# Altium schematic sheet S6.SchDoc
size A3; DocumentNumber: 7; SheetNumber: 7; SheetTotal: 8
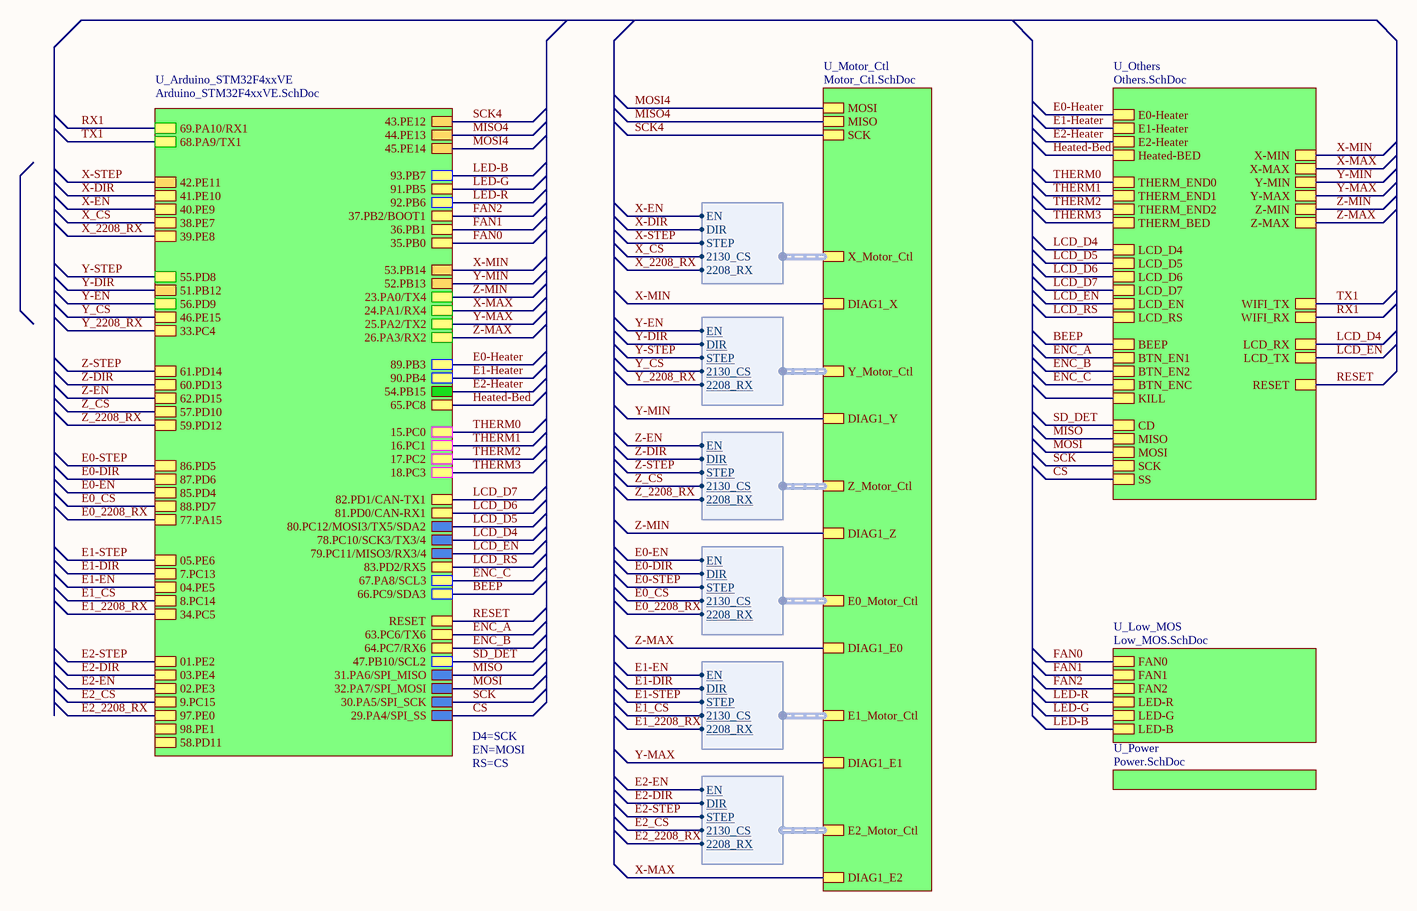
[diagram p0: S6.SchDoc]

## Sub-sheets
U_Arduino_STM32F4xxVE = Arduino_STM32F4xxVE.SchDoc: 23.PA0/TX4, 24.PA1/RX4, 25.PA2/TX2, 26.PA3/RX2, 29.PA4/SPI_SS, 30.PA5/SPI_SCK, 31.PA6/SPI_MISO, 32.PA7/SPI_MOSI, 67.PA8/SCL3, 77.PA15, 35.PB0, 36.PB1, 37.PB2/BOOT1, 89.PB3, 90.PB4, 91.PB5, 92.PB6, 93.PB7, 47.PB10/SCL2, 51.PB12, 52.PB13, 53.PB14, 54.PB15, 15.PC0, 16.PC1, 17.PC2, 18.PC3, 33.PC4, 65.PC8, 66.PC9/SDA3, 7.PC13, 8.PC14, 9.PC15, 85.PD4, 86.PD5, 87.PD6, 88.PD7, 55.PD8, 56.PD9, 57.PD10, 58.PD11, 59.PD12, 60.PD13, 61.PD14, 62.PD15, 97.PE0, 98.PE1, 01.PE2, 02.PE3, 03.PE4, 04.PE5, 05.PE6, 38.PE7, 39.PE8, 40.PE9, 34.PC5, 68.PA9/TX1, 69.PA10/RX1, RESET, 41.PE10, 42.PE11, 43.PE12, 44.PE13, 45.PE14, 46.PE15, 79.PC11/MISO3/RX3/4, 63.PC6/TX6, 81.PD0/CAN-RX1, 83.PD2/RX5, 78.PC10/SCK3/TX3/4, 64.PC7/RX6, 80.PC12/MOSI3/TX5/SDA2, 82.PD1/CAN-TX1
U_Low_MOS = Low_MOS.SchDoc: FAN0, FAN1, FAN2, LED-R, LED-G, LED-B
U_Motor_Ctl = Motor_Ctl.SchDoc: MOSI, MISO, SCK, X_Motor_Ctl (harness Motor), E0_Motor_Ctl (harness Motor), E2_Motor_Ctl (harness Motor), E1_Motor_Ctl (harness Motor), Z_Motor_Ctl (harness Motor), Y_Motor_Ctl (harness Motor), DIAG1_X, DIAG1_Y, DIAG1_Z, DIAG1_E2, DIAG1_E0, DIAG1_E1
U_Others = Others.SchDoc: Heated-BED, THERM_BED, X-MIN, X-MAX, Y-MIN, Y-MAX, Z-MIN, Z-MAX, BTN_ENC, LCD_RS, LCD_D5, LCD_D7, BEEP, LCD_EN, LCD_D4, LCD_D6, CD, BTN_EN2, BTN_EN1, MISO, KILL, MOSI, SS, SCK, E1-Heater, THERM_END2, E2-Heater, THERM_END1, E0-Heater, THERM_END0, RESET, LCD_RX, LCD_TX, WIFI_RX, WIFI_TX
U_Power = Power.SchDoc: no entries

## Harnesses
Motor: EN, DIR, STEP, 2130_CS, 2208_RX

## Nets
BEEP: sheet U_Others/BEEP, sheet U_Arduino_STM32F4xxVE/66.PC9/SDA3
CS: sheet U_Others/SS, sheet U_Arduino_STM32F4xxVE/29.PA4/SPI_SS
E0-DIR: sheet U_Arduino_STM32F4xxVE/87.PD6, sheet U_Motor_Ctl/E0_Motor_Ctl.DIR
E0-EN: sheet U_Arduino_STM32F4xxVE/85.PD4, sheet U_Motor_Ctl/E0_Motor_Ctl.EN
E0-Heater: sheet U_Others/E0-Heater, sheet U_Arduino_STM32F4xxVE/89.PB3
E0-STEP: sheet U_Arduino_STM32F4xxVE/86.PD5, sheet U_Motor_Ctl/E0_Motor_Ctl.STEP
E0_2208_RX: sheet U_Arduino_STM32F4xxVE/77.PA15, sheet U_Motor_Ctl/E0_Motor_Ctl.2208_RX
E0_CS: sheet U_Arduino_STM32F4xxVE/88.PD7, sheet U_Motor_Ctl/E0_Motor_Ctl.2130_CS
E1-DIR: sheet U_Arduino_STM32F4xxVE/7.PC13, sheet U_Motor_Ctl/E1_Motor_Ctl.DIR
E1-EN: sheet U_Arduino_STM32F4xxVE/04.PE5, sheet U_Motor_Ctl/E1_Motor_Ctl.EN
E1-Heater: sheet U_Others/E1-Heater, sheet U_Arduino_STM32F4xxVE/90.PB4
E1-STEP: sheet U_Arduino_STM32F4xxVE/05.PE6, sheet U_Motor_Ctl/E1_Motor_Ctl.STEP
E1_2208_RX: sheet U_Arduino_STM32F4xxVE/34.PC5, sheet U_Motor_Ctl/E1_Motor_Ctl.2208_RX
E1_CS: sheet U_Arduino_STM32F4xxVE/8.PC14, sheet U_Motor_Ctl/E1_Motor_Ctl.2130_CS
E2-DIR: sheet U_Arduino_STM32F4xxVE/03.PE4, sheet U_Motor_Ctl/E2_Motor_Ctl.DIR
E2-EN: sheet U_Arduino_STM32F4xxVE/02.PE3, sheet U_Motor_Ctl/E2_Motor_Ctl.EN
E2-Heater: sheet U_Others/E2-Heater, sheet U_Arduino_STM32F4xxVE/54.PB15
E2-STEP: sheet U_Arduino_STM32F4xxVE/01.PE2, sheet U_Motor_Ctl/E2_Motor_Ctl.STEP
E2_2208_RX: sheet U_Arduino_STM32F4xxVE/97.PE0, sheet U_Motor_Ctl/E2_Motor_Ctl.2208_RX
E2_CS: sheet U_Arduino_STM32F4xxVE/9.PC15, sheet U_Motor_Ctl/E2_Motor_Ctl.2130_CS
ENC_A: sheet U_Others/BTN_EN1, sheet U_Arduino_STM32F4xxVE/63.PC6/TX6
ENC_B: sheet U_Others/BTN_EN2, sheet U_Arduino_STM32F4xxVE/64.PC7/RX6
ENC_C: sheet U_Others/BTN_ENC, sheet U_Arduino_STM32F4xxVE/67.PA8/SCL3
FAN0: sheet U_Low_MOS/FAN0, sheet U_Arduino_STM32F4xxVE/35.PB0
FAN1: sheet U_Low_MOS/FAN1, sheet U_Arduino_STM32F4xxVE/36.PB1
FAN2: sheet U_Low_MOS/FAN2, sheet U_Arduino_STM32F4xxVE/37.PB2/BOOT1
Heated-Bed: sheet U_Others/Heated-BED, sheet U_Arduino_STM32F4xxVE/65.PC8
LCD_D4: sheet U_Others/LCD_D4, sheet U_Others/LCD_RX, sheet U_Arduino_STM32F4xxVE/78.PC10/SCK3/TX3/4
LCD_D5: sheet U_Others/LCD_D5, sheet U_Arduino_STM32F4xxVE/80.PC12/MOSI3/TX5/SDA2
LCD_D6: sheet U_Others/LCD_D6, sheet U_Arduino_STM32F4xxVE/81.PD0/CAN-RX1
LCD_D7: sheet U_Others/LCD_D7, sheet U_Arduino_STM32F4xxVE/82.PD1/CAN-TX1
LCD_EN: sheet U_Others/LCD_EN, sheet U_Others/LCD_TX, sheet U_Arduino_STM32F4xxVE/79.PC11/MISO3/RX3/4
LCD_RS: sheet U_Others/LCD_RS, sheet U_Arduino_STM32F4xxVE/83.PD2/RX5
LED-B: sheet U_Low_MOS/LED-B, sheet U_Arduino_STM32F4xxVE/93.PB7
LED-G: sheet U_Low_MOS/LED-G, sheet U_Arduino_STM32F4xxVE/91.PB5
LED-R: sheet U_Low_MOS/LED-R, sheet U_Arduino_STM32F4xxVE/92.PB6
MISO: sheet U_Others/MISO, sheet U_Arduino_STM32F4xxVE/31.PA6/SPI_MISO
MISO4: sheet U_Motor_Ctl/MISO, sheet U_Arduino_STM32F4xxVE/44.PE13
MOSI: sheet U_Others/MOSI, sheet U_Arduino_STM32F4xxVE/32.PA7/SPI_MOSI
MOSI4: sheet U_Motor_Ctl/MOSI, sheet U_Arduino_STM32F4xxVE/45.PE14
RESET: sheet U_Others/RESET, sheet U_Arduino_STM32F4xxVE/RESET
RX1: sheet U_Others/WIFI_RX, sheet U_Arduino_STM32F4xxVE/69.PA10/RX1
SCK: sheet U_Others/SCK, sheet U_Arduino_STM32F4xxVE/30.PA5/SPI_SCK
SCK4: sheet U_Motor_Ctl/SCK, sheet U_Arduino_STM32F4xxVE/43.PE12
SD_DET: sheet U_Others/CD, sheet U_Arduino_STM32F4xxVE/47.PB10/SCL2
THERM0: sheet U_Others/THERM_END0, sheet U_Arduino_STM32F4xxVE/15.PC0
THERM1: sheet U_Others/THERM_END1, sheet U_Arduino_STM32F4xxVE/16.PC1
THERM2: sheet U_Others/THERM_END2, sheet U_Arduino_STM32F4xxVE/17.PC2
THERM3: sheet U_Others/THERM_BED, sheet U_Arduino_STM32F4xxVE/18.PC3
TX1: sheet U_Others/WIFI_TX, sheet U_Arduino_STM32F4xxVE/68.PA9/TX1
X-DIR: sheet U_Arduino_STM32F4xxVE/41.PE10, sheet U_Motor_Ctl/X_Motor_Ctl.DIR
X-EN: sheet U_Arduino_STM32F4xxVE/40.PE9, sheet U_Motor_Ctl/X_Motor_Ctl.EN
X-MAX: sheet U_Others/X-MAX, sheet U_Motor_Ctl/DIAG1_E2, sheet U_Arduino_STM32F4xxVE/24.PA1/RX4
X-MIN: sheet U_Others/X-MIN, sheet U_Motor_Ctl/DIAG1_X, sheet U_Arduino_STM32F4xxVE/53.PB14
X-STEP: sheet U_Arduino_STM32F4xxVE/42.PE11, sheet U_Motor_Ctl/X_Motor_Ctl.STEP
X_2208_RX: sheet U_Arduino_STM32F4xxVE/39.PE8, sheet U_Motor_Ctl/X_Motor_Ctl.2208_RX
X_CS: sheet U_Arduino_STM32F4xxVE/38.PE7, sheet U_Motor_Ctl/X_Motor_Ctl.2130_CS
Y-DIR: sheet U_Arduino_STM32F4xxVE/51.PB12, sheet U_Motor_Ctl/Y_Motor_Ctl.DIR
Y-EN: sheet U_Arduino_STM32F4xxVE/56.PD9, sheet U_Motor_Ctl/Y_Motor_Ctl.EN
Y-MAX: sheet U_Others/Y-MAX, sheet U_Motor_Ctl/DIAG1_E1, sheet U_Arduino_STM32F4xxVE/25.PA2/TX2
Y-MIN: sheet U_Others/Y-MIN, sheet U_Motor_Ctl/DIAG1_Y, sheet U_Arduino_STM32F4xxVE/52.PB13
Y-STEP: sheet U_Arduino_STM32F4xxVE/55.PD8, sheet U_Motor_Ctl/Y_Motor_Ctl.STEP
Y_2208_RX: sheet U_Arduino_STM32F4xxVE/33.PC4, sheet U_Motor_Ctl/Y_Motor_Ctl.2208_RX
Y_CS: sheet U_Arduino_STM32F4xxVE/46.PE15, sheet U_Motor_Ctl/Y_Motor_Ctl.2130_CS
Z-DIR: sheet U_Arduino_STM32F4xxVE/60.PD13, sheet U_Motor_Ctl/Z_Motor_Ctl.DIR
Z-EN: sheet U_Arduino_STM32F4xxVE/62.PD15, sheet U_Motor_Ctl/Z_Motor_Ctl.EN
Z-MAX: sheet U_Others/Z-MAX, sheet U_Motor_Ctl/DIAG1_E0, sheet U_Arduino_STM32F4xxVE/26.PA3/RX2
Z-MIN: sheet U_Others/Z-MIN, sheet U_Motor_Ctl/DIAG1_Z, sheet U_Arduino_STM32F4xxVE/23.PA0/TX4
Z-STEP: sheet U_Arduino_STM32F4xxVE/61.PD14, sheet U_Motor_Ctl/Z_Motor_Ctl.STEP
Z_2208_RX: sheet U_Arduino_STM32F4xxVE/59.PD12, sheet U_Motor_Ctl/Z_Motor_Ctl.2208_RX
Z_CS: sheet U_Arduino_STM32F4xxVE/57.PD10, sheet U_Motor_Ctl/Z_Motor_Ctl.2130_CS

## Notes on the sheet
- D4=SCK
- EN=MOSI
- RS=CS
- Title
- Size:
- Date:
- A3
- Number:
- Time:
- Revision:
- Sheet
- of
- File: